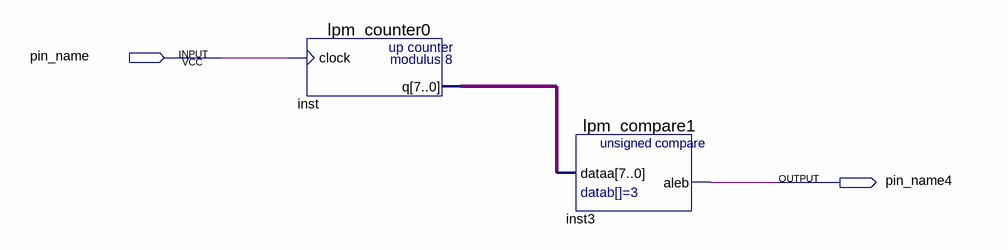
[diagram p0: schematic sheet]
// Quartus schematic lab22.bdf as structural Verilog: 2 symbols, 2 pins
module lab22 (
  input  pin_name,
  output pin_name4
);

  wire [7:0] inst_q;

  lpm_counter0 inst (.clock(pin_name), .q(inst_q));
  lpm_compare1 inst3 (.dataa(inst_q), .aleb(pin_name4));
endmodule
